# Altium project Compensacion.PrjPcb
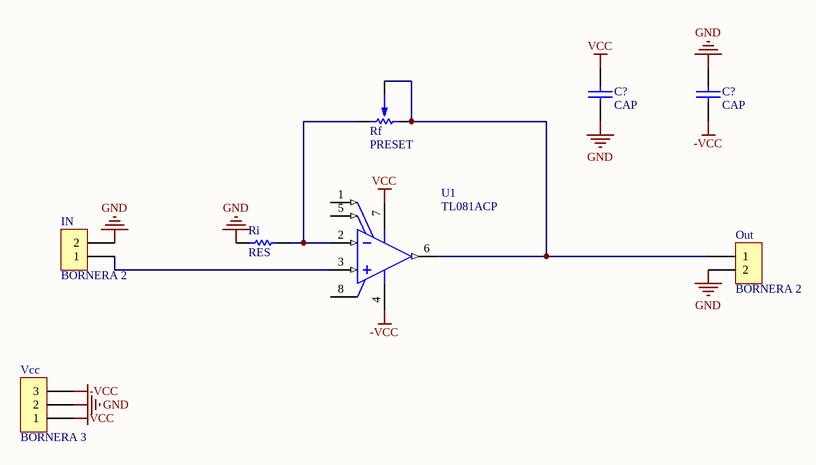
[diagram p0: COMP.SchDoc]
1 sheet, 8 parts. Net scope: global (net labels, ports and power ports of the same name join across sheets).
Board file: COMP.PcbDoc

## Sheet COMP.SchDoc
size A

### Parts
(Parts that share a designator on the sheet are numbered #1, #2 ... from top to bottom, then left to right.)
C?#1  CAP  [0805]
C?#2  CAP  [0805]
IN  BORNERA 2  [BORNERA2]
Out  BORNERA 2  [BORNERA2]
Rf  PRESET  [PRESET V]
Ri  RES  [0805]
U1  TL081ACP  [TI-P8]
Vcc  BORNERA 3  [BORNERA3]

### Nets
-VCC: C?#2.2 U1.4(VCC-) Vcc.3
GND: C?#1.2 C?#2.1 IN.2 Out.2 Ri.1 Vcc.2
VCC: C?#1.1 U1.7(VCC+) Vcc.1
NetIN_1: IN.1 U1.3(IN+)
NetOut_1: Out.1 Rf.2 Rf.3 U1.6(OUT)
NetRf_1: Rf.1 Ri.2 U1.2(IN-)

Not connected (* = marked no-connect by the designer): U1 1(OFFSET_N1) 5(OFFSET_N2) 8(NC)

### Library data of the parts
U1 = TL081ACP: JFET-Input Operational Amplifier, 7 to 36 V, 0 to 70 degC, 8-pin DIP (P8), Pb-Free (RoHS); Manufacturer: Texas Instruments; CMRR(Min)(dB): 75; GBW(Typ)(MHz): 3; IIB(Max)(pA): 200; Iq per channel(Max)(mA): 2.8; Number of Channels: 1; Offset Drift(Typ)(uV/C): 18; Rating: Catalog; Slew Rate(Typ)(V/us): 13; Sub Family: General Purpose Amplifier, High Supply Voltage Amplifier (>=30V); Total Supply Voltage(Max)(+5V is 5, +/-5V is 10): 36; Total Supply Voltage(Min)(+5V is 5, +/-5V is 10): 7; Vio (25C)(Max)(mV): 6; DatasheetVersion: SLOS081G; PackageVersion: 4040082/E, 04/2010; PackageReference: P8; PackageDescription: 8-Pin Plastic In-Line, Body 9.59 x 6.35 mm, Pitch 2.54 mm; Supplier 1: Digi-Key; Supplier Part Number 1: 296-7202-5-ND; Supplier 2: Farnell; Supplier Part Number 2: 1133073; Supplier 3: Newark; Supplier Part Number 3: 68K1132; Supplier 4: Mouser; Supplier Part Number 4: 595-TL081ACP; Eco-Plan: Pb-Free (RoHS); Vn at 1kHz(Typ)(nV/rtHz): 18; Mounting Technology: Through Hole; Code_JEDEC: MS-001; PartNumber: TL081ACP; ComponentLink1Description: Manufacturer URL; ComponentLink1URL: http://www.ti.com/; ComponentLink2Description: Datasheet; ComponentLink2URL: http://www.ti.com/lit/ds/symlink/tl081a.pdf; ComponentLink3Description: Package Specification; ComponentLink3URL: http://www.ti.com/litv/pdf/mpdi001b